# EAGLE design BLE112 Breakout Board v2.0 (EAGLE 6.3)
BLE112 Breakout Board v2.0 Full breakout board for all BLE112 functions, with optional LEDs, programming header, USB access, etc.
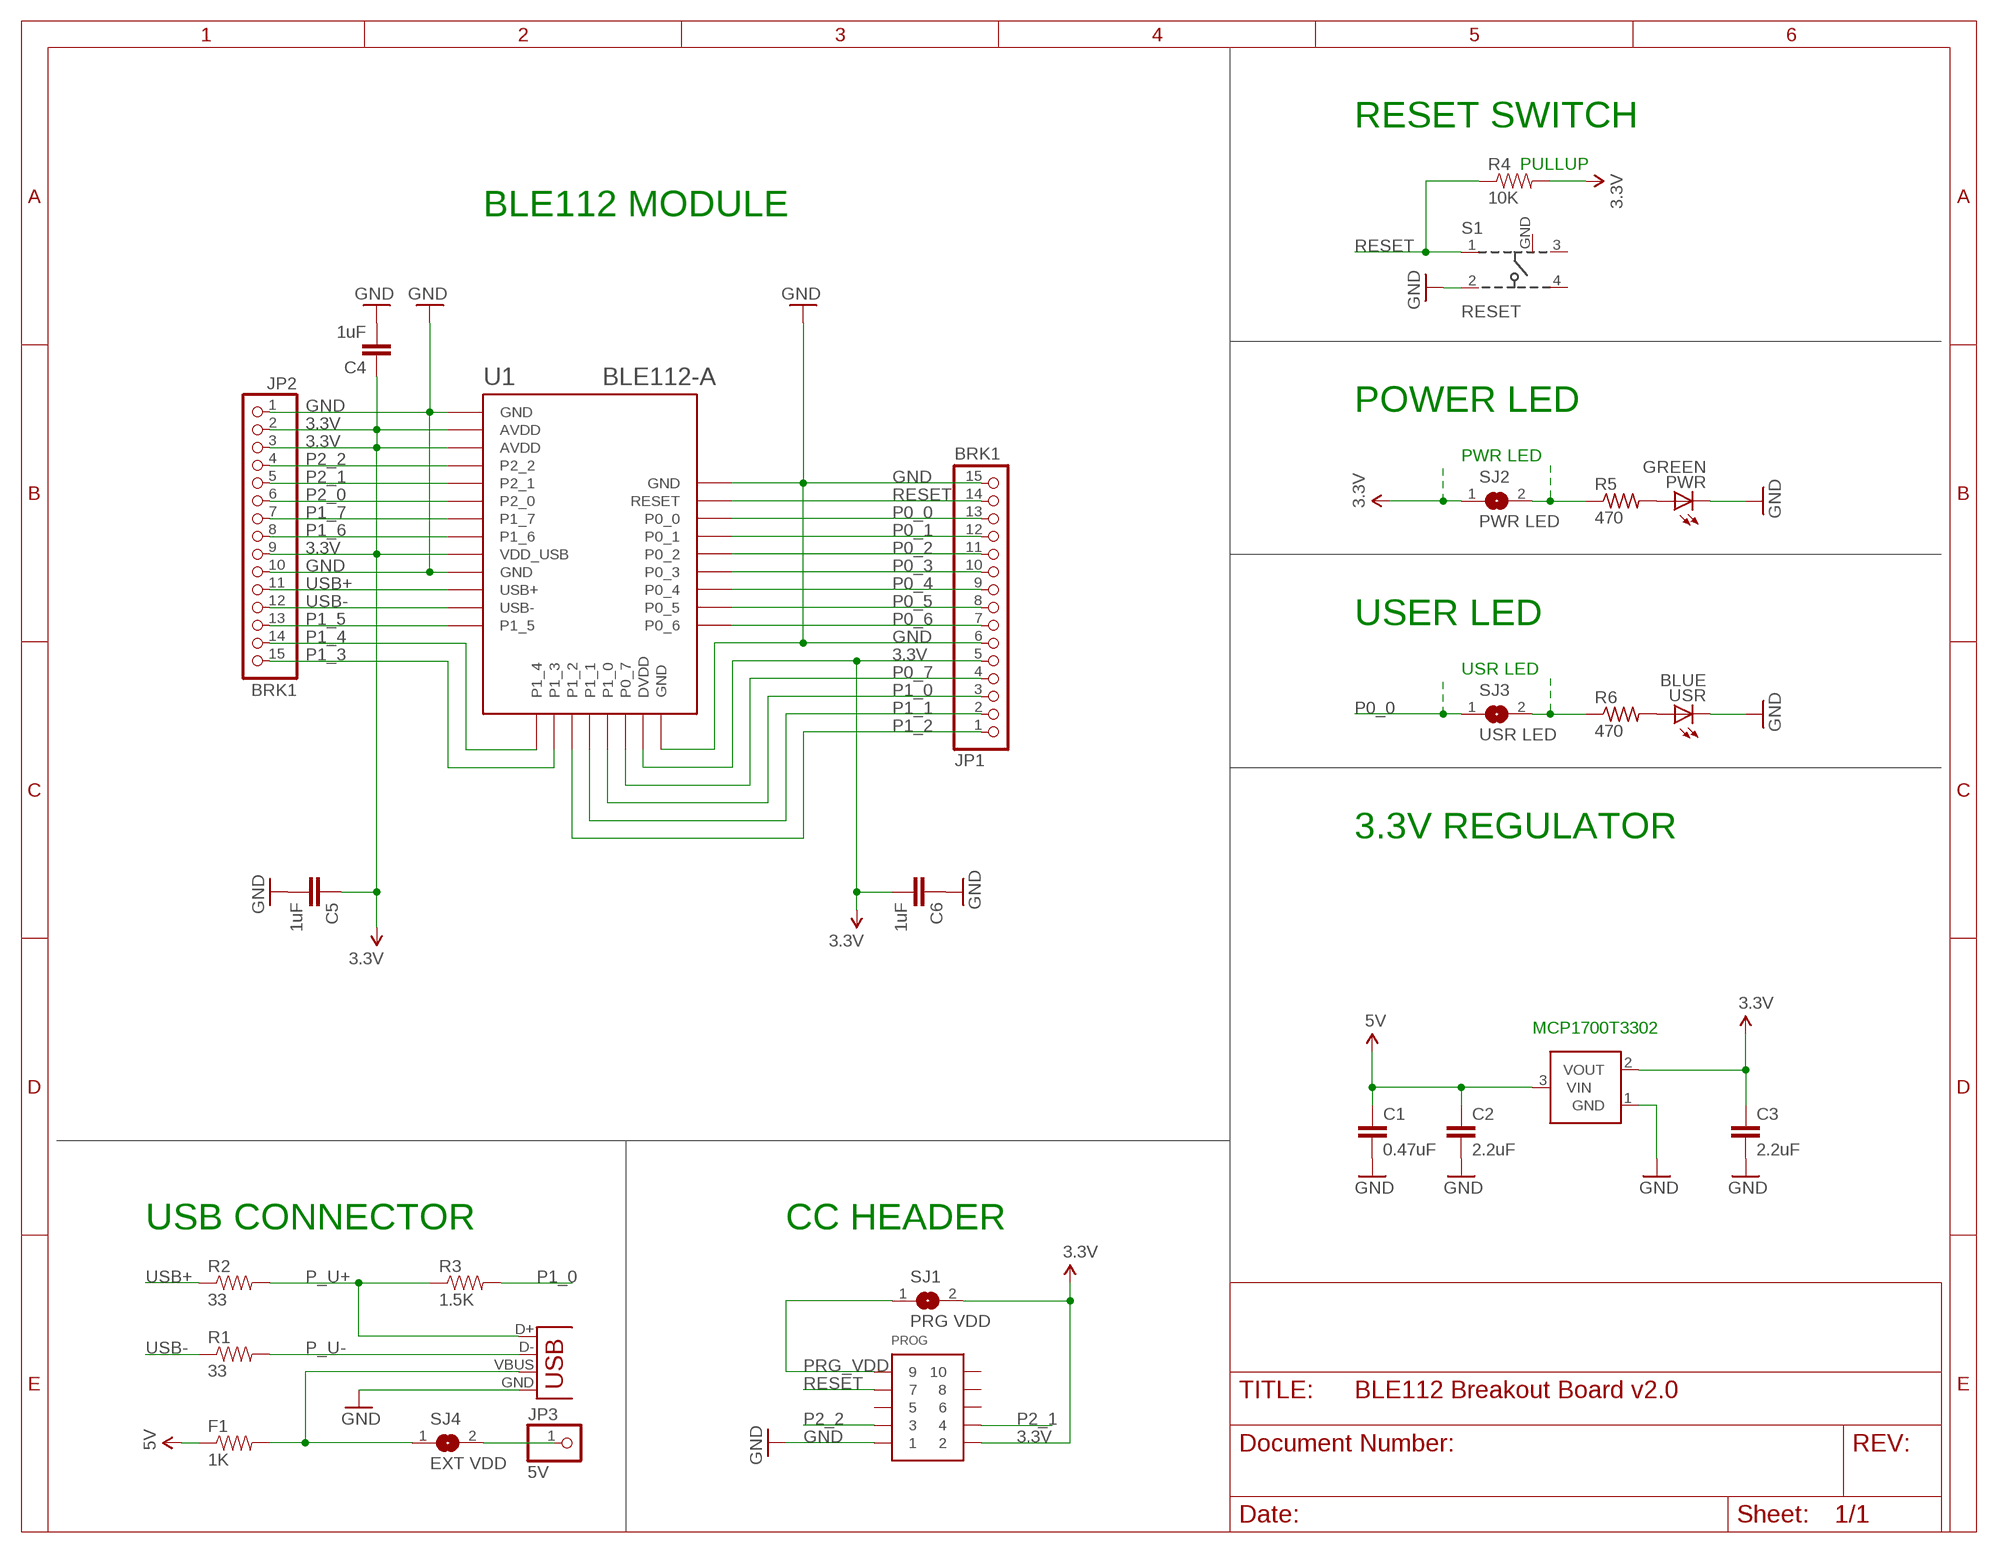
[diagram p0: schematic, sheet 1]

## Parts
C1  0.47uF  CAP0603-CAP  [0603-CAP]
C2  2.2uF  CAP0603-CAP  [0603-CAP]
C3  2.2uF  CAP0603-CAP  [0603-CAP]
C4  1uF  CAP0603-CAP  [0603-CAP]
C5  1uF  CAP0603-CAP  [0603-CAP]
C6  1uF  CAP0603-CAP  [0603-CAP]
F1  1K  RESISTOR0805-RES  [0805]
JP1  BRK1  PINHD-1X15  [1X15]
JP2  BRK1  PINHD-1X15  [1X15]
JP3  5V  PINHD-1X1  [1X01]
PROG  CONN_5-2-FTSH-V  [FTSH-105-DV]
PWR  GREEN  LEDCHIPLED_0805  [CHIPLED_0805]
R1  33  RESISTOR0603-RES  [0603-RES]
R2  33  RESISTOR0603-RES  [0603-RES]
R3  1.5K  RESISTOR0603-RES  [0603-RES]
R4  10K  RESISTOR0603-RES  [0603-RES]
R5  470  R-US_R0603  [R0603]
R6  470  R-US_R0603  [R0603]
S1  RESET  101-IG  [101-IG]
SJ1  PRG VDD  SJ  [SJ]
SJ2  PWR LED  SJ  [SJ]
SJ3  USR LED  SJ  [SJ]
SJ4  EXT VDD  SJ  [SJ]
U1  BLE112-A  BLE112-A-VISUAL  [BLE112-A]
U2  MCP1700  [SOT23-3]
USB  USB-MICROB  [USB-MICROB]
USR  BLUE  LEDCHIPLED_0805  [CHIPLED_0805]

## Nets
3.3V [power]: C3.1 C4.1 C5.1 C6.2 JP1.5 JP2.2 JP2.3 JP2.9 PROG.2 R4.2 SJ1.2 SJ2.1 U1.AVDD1(AVDD) U1.AVDD2(AVDD) U1.DVDD U1.VDD_USB U2.2(VOUT)
5V [power]: C1.1 C2.1 F1.1 U2.3(VIN)
GND [power]: C1.2 C2.2 C3.2 C4.2 C5.2 C6.1 JP1.6 JP1.15 JP2.1 JP2.10 PROG.1 PWR.C S1.2 U1.GND1(GND) U1.GND2(GND) U1.GND3(GND) U1.GND4(GND) U2.1(GND) USB.GND USR.C
N$1: PWR.A R5.2
N$3 [power]: R5.1 SJ2.2
N$4: R6.2 USR.A
N$5: R6.1 SJ3.2
N$7 [power]: JP3.1 SJ4.2
P0_0: JP1.13 SJ3.1 U1.P0_0
P0_1: JP1.12 U1.P0_1
P0_2: JP1.11 U1.P0_2
P0_3: JP1.10 U1.P0_3
P0_4: JP1.9 U1.P0_4
P0_5: JP1.8 U1.P0_5
P0_6: JP1.7 U1.P0_6
P0_7: JP1.4 U1.P0_7
P1_0: JP1.3 R3.2 U1.P1_0
P1_1: JP1.2 U1.P1_1
P1_2: JP1.1 U1.P1_2
P1_3: JP2.15 U1.P1_3
P1_4: JP2.14 U1.P1_4
P1_5: JP2.13 U1.P1_5
P1_6: JP2.8 U1.P1_6
P1_7: JP2.7 U1.P1_7
P2_0: JP2.6 U1.P2_0
P2_1: JP2.5 PROG.4 U1.P2_1
P2_2: JP2.4 PROG.3 U1.P2_2
P_U+: R2.2 R3.1 USB.D+
P_U-: R1.2 USB.D-
PRG_VDD [power]: PROG.9 SJ1.1
RESET: JP1.14 PROG.7 R4.1 S1.1 U1.RESET
USB+: JP2.11 R2.1 U1.USB+
USB-: JP2.12 R1.1 U1.USB-
VBUS [power]: F1.2 SJ4.1 USB.VBUS
Unconnected: PROG.5 PROG.6 PROG.8 PROG.10 S1.3 S1.4

## Notes on the sheet
- RESET SWITCH
- PULLUP
- BLE112 MODULE
- POWER LED
- PWR LED
- USER LED
- USR LED
- 3.3V REGULATOR
- MCP1700T3302
- USB CONNECTOR | CC HEADER

## Power pins joined to a net without a drawn wire
GND: S1.GND

## Library data of the parts
C1-C6 = SparkFun:CAP: Capacitor Standard 0603 ceramic capacitor, and 0.1" leaded capacitor.
F1 R1-R4 = SparkFun:RESISTOR: Resistor Basic schematic elements and footprints for 0603, 1206, and PTH resistors.
JP1 JP2 = sf-pinhead:PINHD-1X15: PIN HEADER
JP3 = adafruit:PINHD-1X1: Pin header 1x1 for 0.1" spacing With round pins
PROG = pel_misc:CONN_5-2
PWR USR = led:LED: LED OSRAM: - CHIPLED LG R971, LG N971, LY N971, LG Q971, LY Q971, LO R971, LY R971 LH N974, LH R974 LS Q976, LO Q976, LY Q976 LO Q996 - Hyper CHIPLED LW Q18S LB Q993, LB Q99A, LB R99A - SideLED LS A670, LO A670, LY A670, LG A670, LP A670 LB A673, LV A673, LT A673, LW A673 LH A674 LY A675 LS A676, LA A676, LO A676, LY A676, LW A676 LS A679, LY A679, LG A679 - Hyper Micro SIDELED® LS Y876, LA Y876, LO Y876, LY Y876 LT Y87S - SmartLED LW L88C, LW L88S LB L89C, LB L89S, LG L890 LS L89K, LO L89K, LY L89K LS L896, LA L896, LO L896, LY L896 - TOPLED LS T670, LO T670, LY T670, LG T670, LP T670 LSG T670, LSP T670, LSY T670, LOP T670, LYG T670 LG T671, LOG T671, LSG T671 LB T673, LV T673, LT T673, LW T673 LH T674 LS T676, LA T676, LO T676, LY T676, LB T676, LH T676, LSB T676, LW T676 LB T67C, LV T67C, LT T67C, LS T67K, LO T67K, LY T67K, LW E67C LS E67B, LA E67B, LO E67B, LY E67B, LB E67C, LV E67C, LT E67C LW T67C LS T679, LY T679, LG T679 LS T770, LO T770, LY T770, LG T770, LP T770 LB T773, LV T773, LT T773, LW T773 LH T774 LS E675, LA E675, LY E675, LS T675 LS T776, LA T776, LO T776, LY T776, LB T776 LHGB T686 LT T68C, LB T68C - Hyper Mini TOPLED® LB M676 - Mini TOPLED Santana® LG M470 LS M47K, LO M47K, LY M47K Source: http://www.osram.convergy.de LUXEON: - LUMILED® LXK2-PW12-R00, LXK2-PW12-S00, LXK2-PW14-U00, LXK2-PW14-V00 LXK2-PM12-R00, LXK2-PM12-S00, LXK2-PM14-U00 LXK2-PE12-Q00, LXK2-PE12-R00, LXK2-PE12-S00, LXK2-PE14-T00, LXK2-PE14-U00 LXK2-PB12-K00, LXK2-PB12-L00, LXK2-PB12-M00, LXK2-PB14-N00, LXK2-PB14-P00, LXK2-PB14-Q00 LXK2-PR12-L00, LXK2-PR12-M00, LXK2-PR14-Q00, LXK2-PR14-R00 LXK2-PD12-Q00, LXK2-PD12-R00, LXK2-PD12-S00 LXK2-PH12-R00, LXK2-PH12-S00 LXK2-PL12-P00, LXK2-PL12-Q00, LXK2-PL12-R00 Source: www.luxeon.com KINGBRIGHT: KA-3528ASYC Source: www.kingbright.com
R5 R6 = resistor:R-US_: RESISTOR, American symbol
S1 = sf-keyglove:101-IG
SJ1-SJ4 = jumper:SJ: SMD solder JUMPER
U1 = sf-bluegiga:BLE112-A-VISUAL: Bluetooth Low Energy single-mode module - Bluetooth 4.0, chip antenna
U2 = nonolith:MCP1700: Voltage regulator
USB = SparkFun:USB: USB Connectors USB-B-PTH is fully proven SKU : PRT-00139 USB-miniB is fully proven SKU : PRT-00587 USB-A-PCB is untested. USB-A-H is throughly reviewed, but untested. Spark Fun Electronics SKU : PRT-00437 USB-B-SMT is throughly reviewed, but untested. Needs silkscreen touching up. USB-A-S has not been used/tested USB-MB-H has not been used/tested

## Net classes
0 default: width 0.152 mm, drill 0.33 mm, clearance 0.152 mm
1 power: width 0.254 mm, drill 0.33 mm, clearance 0.152 mm

## Board
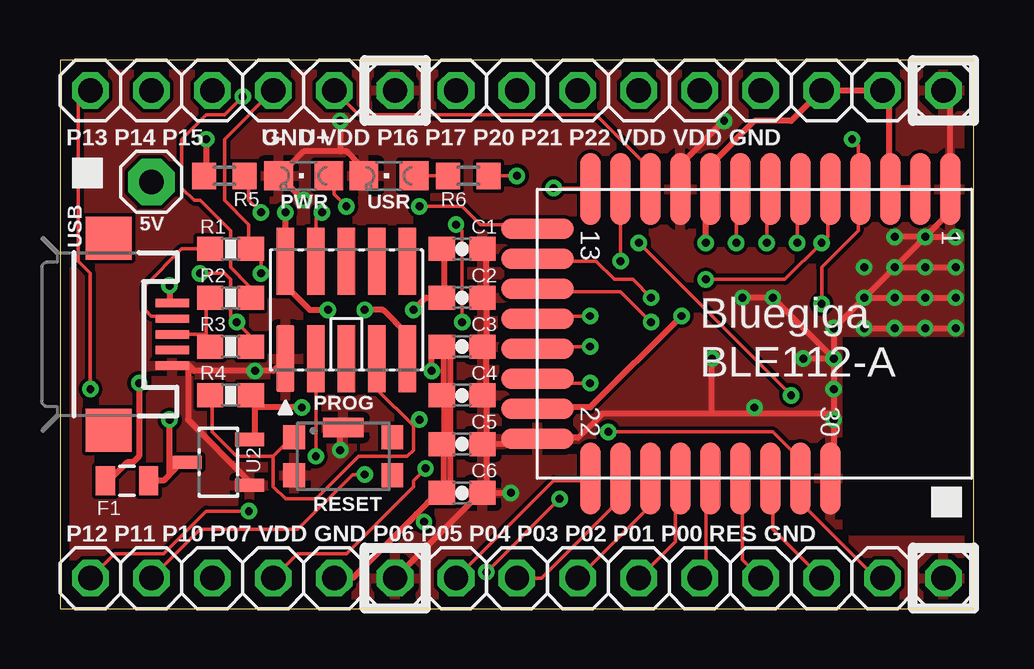
[diagram p1: board, top side]
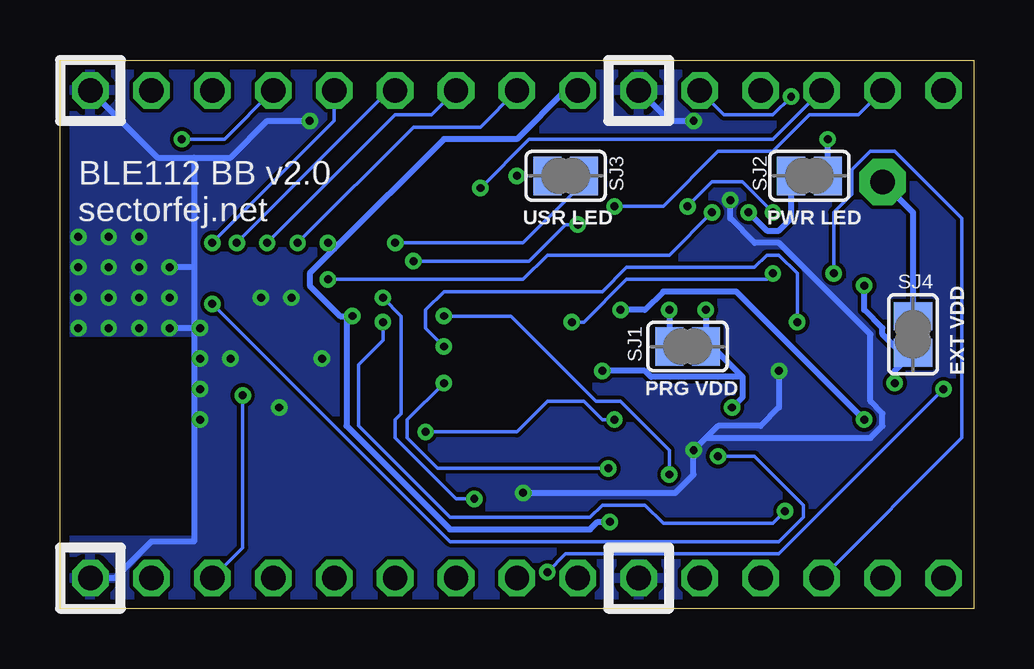
[diagram p2: board, bottom side, seen from below]

Size 38.1 x 22.86 mm. Coordinates in mm from the lower left corner, seen from the top.
Outline: 0,0 38.1,0 38.1,22.86 0,22.86 0,0
Copper layers (1*16): Top 0.0356mm / dielectric 1.5011mm / Bottom 0.0356mm
Design rules "default": minimum track width 6mil, minimum drill 13mil, track to track 6mil, track to pad 6mil, pad to pad 6mil, via to via 6mil, smd to smd 6mil, copper to edge 15mil, drill to drill 6mil, minimum pad ring 7mil, minimum via ring 7mil, stop-mask expansion 4mil, vias tented up to drill 13mil, thermal gap 10mil
tRestrict: area 32.6,3 to 38.1,11.3
bRestrict: area 32.6,3 to 38.1,11.3

### Footprints (pad centres in the part's own frame; a part is rotated, then mirrored left to right if it is on the bottom)
0603-CAP = smd 1.1 x 1: 1 -0.85,0; 2 0.85,0
0805 = smd 0.8 x 1.2: 1 -0.9,0; 2 0.9,0
1X15 = drill 1.016 octagon: 1 -17.78,0; 2 -15.24,0; 3 -12.7,0; 4 -10.16,0; 5 -7.62,0; 6 -5.08,0; 7 -2.54,0; 8 0,0; 9 2.54,0; 10 5.08,0; 11 7.62,0; 12 10.16,0; 13 12.7,0; 14 15.24,0; 15 17.78,0
1X01 = drill 1.016 pad 1.93 octagon: 1 0,0
FTSH-105-DV = smd 0.74 x 2.8: 1 -2.54,-2.03; 2 -2.54,2.03; 3 -1.27,-2.03; 4 -1.27,2.03; 5 0,-2.03; 6 0,2.03; 7 1.27,-2.03; 8 1.27,2.03; 9 2.54,-2.03; 10 2.54,2.03
CHIPLED_0805 = smd 1.2 x 1.2: A 0,-1.05; C 0,1.05
0603-RES = smd 1.1 x 1: 1 -0.85,0; 2 0.85,0
R0603 = smd 1 x 1.1: 1 -0.85,0; 2 0.85,0
101-IG = smd 0.9 x 1: 1 -2.05,0.8; 2 -2.05,-0.8; 3 2.05,0.8; 4 2.05,-0.8 | smd 1.7 x 0.8: GND 0,1.2
SJ = smd 1.168 x 1.6: 1 -0.762,0; 2 0.762,0
BLE112-A = smd 3 x 0.85: AVDD1 -6.05,6.9; AVDD2 -6.05,5.65; GND1 -6.05,8.15; GND2 -6.05,-3.1; GND4 6,3.15; P0_0 6,0.65; P0_1 6,-0.6; P0_2 6,-1.85; P0_3 6,-3.1; P0_4 6,-4.35; P0_5 6,-5.6; P0_6 6,-6.85; P1_5 -6.05,-6.85; P1_6 -6.05,-0.6; P1_7 -6.05,0.65; P2_0 -6.05,1.9; P2_1 -6.05,3.15; P2_2 -6.05,4.4; RESET 6,1.9; USB+ -6.05,-4.35; USB- -6.05,-5.6; VDD_USB -6.05,-1.85 | smd 0.85 x 3: DVDD 3.1,-9.05; GND3 4.35,-9.05; P0_7 1.85,-9.05; P1_0 0.6,-9.05; P1_1 -0.65,-9.05; P1_2 -1.9,-9.05; P1_3 -3.15,-9.05; P1_4 -4.4,-9.05
SOT23-3 = smd 0.55 x 1.2: 1 0.95,1.3; 2 -0.95,1.3; 3 0,-1.3
USB-MICROB = smd 0.35 x 1.4: D+ 0,2.65; D- -0.65,2.65; GND 1.3,2.65; ID 0.65,2.65; VBUS -1.3,2.65 | smd 1.8 x 1.9: MT1 -4,0; MT2 4,0

### Placement (x,y rotation side)
C1  16.76,14.99 0 top
C2  16.76,12.95 0 top
C3  16.76,10.92 0 top
C4  16.76,8.89 0 top
C5  16.76,6.86 0 top
C6  16.76,4.83 180 top
F1  2.79,5.33 180 top
JP1  19.05,1.27 0 top
JP2  19.05,21.59 180 top
JP3  3.81,17.78 0 top
PROG  11.94,12.45 0 top
PWR  10.16,18.03 90 top
R1  7.11,14.99 180 top
R2  7.11,12.95 180 top
R3  7.11,10.92 0 top
R4  7.11,8.89 0 top
R5  6.86,18.03 0 top
R6  17.02,18.03 180 top
S1  11.81,6.35 0 top
SJ1  11.94,10.92 0 bottom
SJ2  6.86,18.03 0 bottom
SJ3  17.02,18.03 180 bottom
SJ4  2.54,11.43 90 bottom
U1  28.96,11.43 270 top
U2  6.6,6.1 270 top
USB  2.03,11.43 270 top
USR  13.72,18.03 90 top

### Tracks (layer width: path | path; a pad name or v marks a point on that pad's centre or on a via)
3.3V  (via drill 0.33)
  Top 0.254: v9.4,16.51 PROG.2 9.4,13.46 10.41,12.45 v11.18,12.45 | JP1.5 12.19,1.27 14.86,3.94 | 14.86,3.94 15.75,4.83 C6.2 16,4.83 | U1.AVDD1 35.81,17.53 34.8,17.53 U1.AVDD2 34.54,17.53 34.54,21.34 JP2.2 JP2.3 30.48,20.32 28.96,20.32 27.18,18.54 27.18,17.53 U1.VDD_USB 26.92,17.27 v26.92,15.24 | v25.91,12.19 22.1,8.38 20.07,8.38 U1.DVDD | v15.18,3.62 14.86,3.94 | 16,8.89 16,6.86 | 16,8.89 16,10.92 C3.1 | 16,8.89 C4.1 | 16,4.83 16,6.86 | 16,6.86 C5.1 | 8.13,8.38 8.13,7.11 U2.2 | 8.13,8.38 8.13,8.89 R4.2 | v10.08,8.38 8.13,8.38 | 16,4.83 16.26,5.08 16.26,10.92 16,11.18 15.75,11.18 15.49,10.92 v15.49,9.91
  Bottom 0.254: SJ2.1 7.62,16.26 8.13,15.75 8.64,15.75 v9.4,16.51 | v11.18,12.45 11.18,11.18 | 26.16,12.19 26.42,12.19 27.69,13.46 27.69,13.97 26.67,14.99 | 26.67,14.99 22.1,19.56 19.05,19.56 17.02,21.59 JP2.9 | 26.67,14.99 v26.92,15.24 | v15.18,3.62 15.68,3.62 16,3.3 21.84,3.3 26.16,7.62 26.16,12.19 | 26.16,12.19 v25.91,12.19 | v10.08,8.38 9.65,8.81 9.65,9.65 | 11.18,11.18 9.65,9.65 | 11.18,11.18 SJ1.2 | v15.49,9.91 13.72,9.91 13.46,9.65 9.65,9.65
5V  (via drill 0.33)
  Top 0.254: C1.1 16,14.99 16,12.95 C2.1 15.24,12.95 v14.73,12.45 | F1.1 4.32,5.33 4.57,5.59 | 4.57,5.59 5.08,6.1 U2.3 | 4.57,5.59 v4.57,7.87
  Bottom 0.254: v14.73,12.45 13.72,12.45 12.95,13.21 9.91,13.21 v4.57,7.87
GND  (via drill 0.33)
  Top 0.254: PROG.1 8.89,9.91 v8.13,9.91 5.59,9.91 5.33,10.16 | 5.33,10.16 4.83,10.16 USB.GND 5.33,10.16 | JP1.6 17.53,4.83 C6.1 17.78,4.83 | v32.26,10.41 v32.26,11.68 v33.53,12.95 | v32.26,10.41 32.26,8.13 | 32.26,8.13 32.26,5.59 U1.GND4 | v36.07,15.49 37.08,16.51 37.08,17.27 U1.GND1 37.08,17.53 37.08,21.34 JP2.1 | v36.07,15.49 v34.8,14.22 | v34.8,14.22 v33.53,12.95 | v27.69,20.32 25.91,18.54 25.91,17.53 U1.GND2 | 32.26,8.13 28.96,8.13 | 28.96,8.13 27.18,8.13 | 27.18,8.13 22.61,8.13 21.59,7.11 20.07,7.11 U1.GND3 19.81,6.86 17.78,6.86 | 9.14,18.03 10.16,19.05 11.68,19.05 | 11.68,19.05 11.94,19.05 12.45,18.54 12.45,18.03 USR.C | v11.68,20.32 11.68,19.05 | 7.87,5.33 5.33,7.87 5.33,10.16 | v11.68,6.6 11.68,7.37 S1.GND | 17.78,12.95 17.78,10.92 | 17.78,12.95 17.78,14.99 C1.2 | 17.78,12.95 C2.2 | 17.78,8.89 17.78,6.86 | v28.45,12.95 v29.72,12.95 v32.26,10.41 | 27.18,8.13 v27.18,10.41 | 28.96,8.13 v28.96,8.38 | v32.26,10.41 v30.99,10.41 | v33.53,11.68 v34.8,11.68 v36.07,11.68 v37.34,11.68 | v33.53,12.95 v34.8,12.95 v36.07,12.95 v37.34,12.95 | v34.8,14.22 v36.07,14.22 v37.34,14.22 | v36.07,15.49 v34.8,15.49 | v36.07,15.49 v37.34,15.49 | 17.78,8.89 17.78,10.92 | 17.78,10.92 C3.2 | 17.78,8.89 C4.2 | 17.78,6.86 17.78,4.83 | 17.78,6.86 C5.2 | 17.78,4.83 v18.8,4.83 | v10.16,17.02 9.14,18.03 | 9.14,18.03 PWR.C
  Bottom 0.254: v27.69,20.32 29.46,20.32 30.99,18.8 32.51,18.8 | 32.51,18.8 34.04,18.8 JP2.1 | JP1.15 35.81,1.27 34.29,2.79 32.51,2.79 32.51,11.68 | 32.51,18.8 32.51,14.22 | 32.51,14.22 32.51,11.68 | v11.68,20.32 12.7,20.32 JP2.10 | 11.18,7.11 10.67,7.62 8.89,7.62 8.13,8.38 v8.13,9.91 | 11.18,7.11 v11.68,6.6 11.68,5.59 12.45,4.83 v18.8,4.83 | 32.51,11.68 v33.53,11.68 | 32.51,11.68 v32.26,11.68 | 32.51,14.22 v33.53,14.22 | v10.16,17.02 10.16,16.26 9.14,15.24 8.13,15.24 4.32,11.43 4.32,8.64 3.81,8.13 3.81,7.62 4.32,7.11 11.18,7.11
  other vias: 32.26,9.14 32.26,7.87
  pour Bottom: 0,22.86 38.1,22.86 38.1,0 0,0
  pour Top: 0,22.86 38.1,22.86 38.1,0 0,0
N$1  (via drill 0.33)
  Top 0.152: v8.38,16.51 7.87,17.02 7.87,18.03 R5.2 | v11.94,16.76 11.43,17.27 11.43,18.03 PWR.A
  Bottom 0.152: v8.38,16.51 9.65,17.78 10.92,17.78 v11.94,16.76
N$3  (via drill 0.33)
  Top 0.254: v6.1,19.56 SJ2.2 R5.1
  Bottom 0.254: SJ2.2 v6.1,19.56
N$4
  Top 0.152: USR.A R6.2
N$5  (via drill 0.33)
  Top 0.152: v19.05,18.03 R6.1
  Bottom 0.152: SJ3.2 v19.05,18.03
N$6
  Bottom 0.152: 6.35,18.03 7.37,18.03
N$7
  Bottom 0.254: SJ4.2 2.54,16.51 JP3.1
N$8
  Bottom 0.152: 16.51,18.03 17.53,18.03
N$9
  Bottom 0.152: 11.43,10.92 12.45,10.92
N$10
  Bottom 0.152: 2.54,11.94 2.54,10.92
P0_0  (via drill 0.33)
  Top 0.152: v30.48,8.89 v24.13,15.24 | JP1.13 29.72,3.3 29.72,5.33 U1.P0_0
  Bottom 0.152: SJ3.1 16.76,17.53 16.76,17.27 18.8,15.24 v24.13,15.24 | v30.48,8.89 30.48,2.54 JP1.13
P0_1
  Top 0.152: JP1.12 28.45,2.03 28.45,5.33 U1.P0_1
P0_2
  Top 0.152: JP1.11 26.92,1.52 26.92,5.33 U1.P0_2
P0_3
  Top 0.152: JP1.10 25.65,2.79 25.65,5.33 U1.P0_3
P0_4
  Top 0.152: JP1.9 24.38,4.06 24.38,5.33 U1.P0_4
P0_5
  Top 0.152: JP1.8 20.07,1.27 23.11,4.32 23.11,5.33 U1.P0_5
P0_6
  Top 0.152: JP1.7 20.57,5.33 22.1,5.33 U1.P0_6
P0_7  (via drill 0.33)
  Top 0.152: v22.1,9.4 20.07,9.4 U1.P0_7 | v15.24,5.84 14.73,5.33 14.73,5.08 11.94,2.29 9.91,2.29 JP1.4
  Bottom 0.152: v22.1,9.4 23.62,7.87 23.62,7.11 22.35,5.84 v15.24,5.84
P1_0  (via drill 0.33)
  Top 0.152: v5.84,13.97 6.86,13.97 7.11,13.72 7.11,12.19 v7.37,11.94 7.87,11.43 7.87,10.92 R3.2 | v22.1,10.92 20.07,10.92 U1.P1_0
  Bottom 0.152: v5.84,13.97 5.84,16.51 5.08,17.27 5.08,18.29 4.32,19.05 3.3,19.05 0.51,16.26 0.51,7.11 JP1.3 | v22.1,10.92 22.86,11.68 22.86,12.45 22.1,13.21 15.49,13.21 14.48,14.22 9.14,14.22 8.64,14.73 8.13,14.73 7.37,13.97 v7.37,11.94
P1_1  (via drill 0.33)
  Top 0.152: v22.1,12.19 20.07,12.19 U1.P1_1 | v12.7,5.59 12.19,5.59 9.91,3.3 5.84,3.3 JP1.2
  Bottom 0.152: v22.1,12.19 19.3,12.19 15.75,8.64 14.73,8.64 12.7,6.6 v12.7,5.59
P1_2  (via drill 0.33)
  Top 0.152: v24.64,11.94 23.37,13.21 20.07,13.21 U1.P1_2 | v7.87,4.06 6.1,4.06 4.32,2.29 2.29,2.29 JP1.1
  Bottom 0.152: v24.64,11.94 24.64,11.18 25.65,10.16 25.65,7.62 21.84,3.81 16,3.81 15.49,4.32 13.72,4.32 12.95,3.56 8.38,3.56 v7.87,4.06
P1_3  (via drill 0.33)
  Top 0.152: v24.64,12.95 23.88,13.72 23.11,13.72 22.35,14.48 20.07,14.48 U1.P1_3 | v17.78,1.52 v20.83,4.57 | v1.27,9.14 1.27,13.97 0.76,14.48 0.76,21.08 JP2.15
  Bottom 0.152: v24.64,12.95 23.88,12.19 23.88,8.13 24.13,7.87 24.13,7.11 21.59,4.57 v20.83,4.57 | v17.78,1.52 17.02,2.29 8.13,2.29 v1.27,9.14
P1_4  (via drill 0.33)
  Top 0.152: v14.99,16.76 16.76,16.76 17.53,16 19.81,16 U1.P1_4
  Bottom 0.152: v14.99,16.76 12.95,16.76 10.67,19.05 8.38,19.05 6.86,20.57 4.83,20.57 JP2.14
P1_5  (via drill 0.33)
  Top 0.152: v20.57,17.53 22.1,17.53 U1.P1_5
  Bottom 0.152: v20.57,17.53 18.54,19.56 8.38,19.56 JP2.13
P1_6  (via drill 0.33)
  Top 0.152: v28.19,15.24 28.19,17.27 U1.P1_6
  Bottom 0.152: v28.19,15.24 23.37,20.07 20.57,20.07 JP2.8
P1_7  (via drill 0.33)
  Top 0.152: v29.46,15.24 29.46,17.27 U1.P1_7
  Bottom 0.152: v29.46,15.24 24.13,20.57 22.61,20.57 JP2.7
P2_0  (via drill 0.33)
  Top 0.152: v30.73,15.24 30.73,17.27 U1.P2_0
  Bottom 0.152: v30.73,15.24 24.38,21.59 JP2.6
P2_1  (via drill 0.33)
  Top 0.152: PROG.4 10.67,16.26 v10.92,16.51 | v26.92,13.72 30.23,13.72 v31.75,15.24 32,15.49 32,17.27 U1.P2_1
  Bottom 0.152: v10.92,16.51 12.7,14.73 17.78,14.73 18.8,13.72 v26.92,13.72 | JP2.5 26.67,20.32 v31.75,15.24
P2_2  (via drill 0.33)
  Top 0.152: v10.67,6.35 PROG.3 | v31.75,12.7 31.75,14.22 33.27,15.75 33.27,17.27 U1.P2_2 33.27,17.53 33.27,19.3 v33.02,19.56
  Bottom 0.152: v10.67,6.35 9.14,6.35 7.11,4.32 7.11,3.81 8.13,2.79 21.84,2.79 v31.75,12.7 | v33.02,19.56 31.24,19.56 JP2.4
P_U+
  Top 0.152: 6.1,11.43 6.1,12.95 R2.2 | 6.1,11.43 6.1,10.92 R3.1 | 6.1,11.43 USB.D+
P_U-
  Top 0.152: R1.2 5.08,14.99 3.56,13.46 3.56,12.45 3.81,12.19 4.57,12.19 USB.D-
PRG_VDD  (via drill 0.33)
  Top 0.254: v12.7,12.45 13.46,12.45 14.48,11.43 PROG.9
  Bottom 0.254: v12.7,12.45 SJ1.1
RESET  (via drill 0.33)
  Top 0.152: JP1.14 34.04,1.27 30.99,4.32 30.99,5.33 U1.RESET 30.73,5.59 30.73,6.35 29.72,7.37 v22.86,7.37 | 8.89,6.35 9.65,7.11 S1.1 | 8.89,6.35 7.37,6.35 6.35,7.37 6.35,8.89 R4.1 | PROG.7 13.21,9.14 14.73,7.62 | 14.73,7.62 14.73,6.6 14.48,6.35 12.45,6.35 10.67,4.57 9.4,4.57 8.89,5.08 8.89,6.35 | 14.73,7.62 v14.99,7.87
  Bottom 0.152: v22.86,7.37 19.05,7.37 17.78,8.64 16.26,8.64 15.49,7.87 v14.99,7.87
USB+  (via drill 0.33)
  Top 0.152: v7.62,21.34 6.86,20.57 6.1,20.57 5.08,19.56 5.08,17.53 5.59,17.02 5.84,17.02 7.11,15.75 7.11,14.22 7.87,13.46 7.87,12.95 R2.1 | JP2.11 12.45,20.57 22.35,20.57 24.38,18.54 24.38,17.53 U1.USB+
  Bottom 0.152: v7.62,21.34 8.38,20.57 10.41,20.57 JP2.11
USB-  (via drill 0.33)
  Top 0.152: JP2.12 6.86,19.56 6.86,17.02 7.87,16 7.87,14.99 R1.1 8.13,14.99 8.38,14.73 v8.38,13.97 | v23.37,14.48 23.37,17.27 U1.USB- | v16.51,16 16.76,15.75 v16.76,11.94
  Bottom 0.152: v23.37,14.48 18.54,14.48 17.02,16 v16.51,16 | v16.76,11.94 16.26,11.94 14.48,13.72 8.64,13.72 v8.38,13.97
VBUS  (via drill 0.33)
  Top 0.254: v3.3,9.4 3.3,6.35 3.05,6.1 2.79,6.1 2.03,5.33 F1.2 | v4.57,13.46 4.57,12.7 USB.VBUS
  Bottom 0.254: v3.3,9.4 3.3,9.91 2.79,10.41 | v4.57,13.46 4.57,12.45 3.81,11.68 3.81,11.43 2.79,10.41 | 2.79,10.41 SJ4.1

### Text on the board
tPlace: P13 P14 P15 GND VDD P16 P17 P20 P21 P22 VDD VDD GND | U- U+ | 5V | Bluegiga | BLE112-A | RESET | P12 P11 P10 P07 VDD GND P06 P05 P04 P03 P02 P01 P00 RES GND
bPlace: BLE112 BB v2.0 | PWR LED | USR LED | sectorfej.net | EXT VDD | PRG VDD